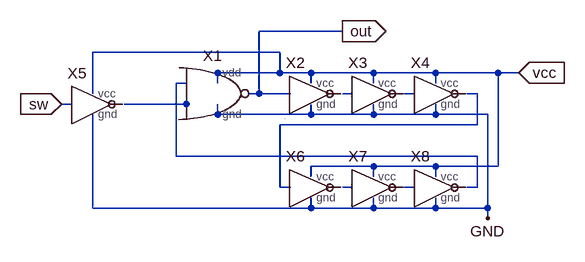
[diagram p0: schematic ring7_nand.asc]
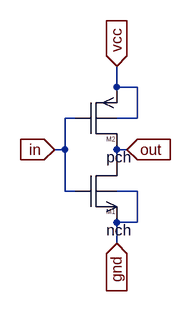
[diagram p1: sub-circuit myinv.asc]
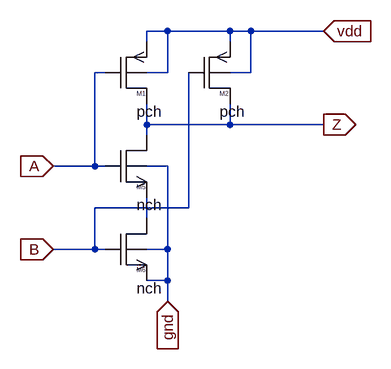
[diagram p2: sub-circuit mynand2.asc]
ring7_nand.asc, the LTspice schematic file:
Version 4
SHEET 1 880 680
WIRE 320 144 192 144
WIRE 224 176 -64 176
WIRE 224 208 224 176
WIRE 224 208 128 208
WIRE 272 208 224 208
WIRE 368 208 272 208
WIRE 464 208 368 208
WIRE 560 208 464 208
WIRE 592 208 560 208
WIRE 80 224 64 224
WIRE 128 224 128 208
WIRE 272 224 272 208
WIRE 368 224 368 208
WIRE 464 224 464 208
WIRE -64 240 -64 176
WIRE 192 240 192 144
WIRE 192 240 176 240
WIRE 240 240 192 240
WIRE 336 240 320 240
WIRE 432 240 416 240
WIRE 528 240 512 240
WIRE -96 256 -112 256
WIRE 80 256 80 240
WIRE 80 256 -16 256
WIRE 128 272 128 256
WIRE 272 272 272 256
WIRE 272 272 128 272
WIRE 368 272 368 256
WIRE 368 272 272 272
WIRE 464 272 464 256
WIRE 464 272 368 272
WIRE 544 272 464 272
WIRE 528 288 528 240
WIRE 528 288 224 288
WIRE 64 336 64 224
WIRE 528 336 64 336
WIRE 368 352 272 352
WIRE 464 352 368 352
WIRE 560 352 560 208
WIRE 560 352 464 352
WIRE 272 368 272 352
WIRE 368 368 368 352
WIRE 464 368 464 352
WIRE 224 384 224 288
WIRE 240 384 224 384
WIRE 336 384 320 384
WIRE 432 384 416 384
WIRE 528 384 528 336
WIRE 528 384 512 384
WIRE -64 416 -64 272
WIRE 272 416 272 400
WIRE 272 416 -64 416
WIRE 368 416 368 400
WIRE 368 416 272 416
WIRE 464 416 464 400
WIRE 464 416 368 416
WIRE 544 416 544 272
WIRE 544 416 464 416
WIRE 544 432 544 416
FLAG 544 432 GND
FLAG 592 208 vcc
IOPIN 592 208 In
FLAG 320 144 out
IOPIN 320 144 Out
FLAG -112 256 sw
IOPIN -112 256 In
SYMBOL myinv 272 256 R0
SYMATTR InstName X2
SYMBOL myinv 368 256 R0
SYMATTR InstName X3
SYMBOL myinv 464 256 R0
SYMATTR InstName X4
SYMBOL myinv 272 400 R0
SYMATTR InstName X6
SYMBOL myinv 368 400 R0
SYMATTR InstName X7
SYMBOL myinv 464 400 R0
SYMATTR InstName X8
SYMBOL mynand2 128 272 R0
SYMATTR InstName X1
SYMBOL myinv -64 272 R0
SYMATTR InstName X5

myinv.asc, the sub-circuit schematic file:
Version 4
SHEET 1 880 680
WIRE 176 32 176 0
WIRE 208 32 176 32
WIRE 112 80 96 80
WIRE 208 80 208 32
WIRE 208 80 176 80
WIRE 96 128 96 80
WIRE 96 128 80 128
WIRE 192 128 176 128
WIRE 176 144 176 128
WIRE 96 192 96 128
WIRE 112 192 96 192
WIRE 208 192 176 192
WIRE 208 240 208 192
WIRE 208 240 176 240
WIRE 176 272 176 240
FLAG 176 272 gnd
IOPIN 176 272 In
FLAG 176 0 vcc
IOPIN 176 0 In
FLAG 80 128 in
IOPIN 80 128 In
FLAG 192 128 out
IOPIN 192 128 In
SYMBOL nmos4 112 192 R0
WINDOW 3 48 60 Left 2
SYMATTR InstName M1
SYMATTR Value nch
SYMATTR Value2 l=2u w=6u
SYMBOL pmos4 112 80 R0
WINDOW 3 48 60 Left 2
SYMATTR InstName M2
SYMATTR Value pch
SYMATTR Value2 l=2u w=18u

mynand2.asc, the sub-circuit schematic file:
Version 4
SHEET 1 880 680
WIRE 128 -240 96 -240
WIRE 224 -240 128 -240
WIRE 256 -240 224 -240
WIRE 368 -240 256 -240
WIRE 96 -224 96 -240
WIRE 224 -224 224 -240
WIRE 32 -176 16 -176
WIRE 128 -176 128 -240
WIRE 128 -176 96 -176
WIRE 256 -176 256 -240
WIRE 256 -176 224 -176
WIRE 96 -96 96 -128
WIRE 224 -96 224 -128
WIRE 224 -96 96 -96
WIRE 368 -96 224 -96
WIRE 96 -80 96 -96
WIRE 16 -32 16 -176
WIRE 16 -32 -48 -32
WIRE 32 -32 16 -32
WIRE 128 -32 96 -32
WIRE 160 32 160 -176
WIRE 160 32 16 32
WIRE 96 48 96 16
WIRE 16 96 16 32
WIRE 16 96 -48 96
WIRE 32 96 16 96
WIRE 128 96 128 -32
WIRE 128 96 96 96
WIRE 128 144 128 96
WIRE 128 144 96 144
WIRE 128 176 128 144
FLAG -48 -32 A
IOPIN -48 -32 In
FLAG -48 96 B
IOPIN -48 96 In
FLAG 368 -96 Z
IOPIN 368 -96 Out
FLAG 128 176 gnd
IOPIN 128 176 In
FLAG 368 -240 vdd
IOPIN 368 -240 In
SYMBOL pmos4 32 -176 R0
WINDOW 3 48 60 Left 2
SYMATTR InstName M1
SYMATTR Value pch
SYMATTR Value2 l=2u w=18u
SYMBOL pmos4 160 -176 R0
WINDOW 3 48 60 Left 2
SYMATTR InstName M2
SYMATTR Value pch
SYMATTR Value2 l=2u w=18u
SYMBOL nmos4 32 -32 R0
WINDOW 3 48 60 Left 2
SYMATTR InstName M5
SYMATTR Value nch
SYMATTR Value2 l=2u w=6u
SYMBOL nmos4 32 96 R0
WINDOW 3 48 60 Left 2
SYMATTR InstName M6
SYMATTR Value nch
SYMATTR Value2 l=2u w=6u

The netlist it stands for:
* ring7_nand.asc
XX2 GND out N002 vcc myinv
XX3 GND N002 N003 vcc myinv
XX4 GND N003 N004 vcc myinv
XX6 GND N004 N006 vcc myinv
XX7 GND N006 N007 vcc myinv
XX8 GND N007 N001 vcc myinv
XX1 N001 N005 GND vcc out mynand2
XX5 GND sw N005 vcc myinv

* block symbol definitions
.subckt myinv gnd in out vcc
M1 out in gnd gnd nch l=2u w=6u
M2 out in vcc vcc pch l=2u w=18u
.ends myinv

.subckt mynand2 A B gnd vdd Z
M1 Z A vdd vdd pch l=2u w=18u
M2 Z B vdd vdd pch l=2u w=18u
M5 Z A N001 gnd nch l=2u w=6u
M6 N001 B gnd gnd nch l=2u w=6u
.ends mynand2

.model NMOS NMOS
.model PMOS PMOS
.lib standard.mos
.backanno
.end